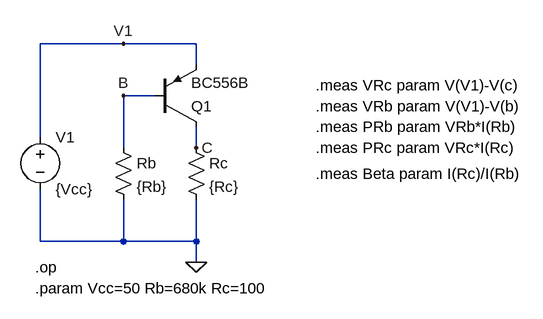
[diagram p0: schematic TBJ02.asc]
TBJ02.asc, the LTspice schematic file:
Version 4
SHEET 1 984 680
WIRE 256 -32 128 -32
WIRE 368 -32 256 -32
WIRE 368 0 368 -32
WIRE 304 48 256 48
WIRE 128 112 128 -32
WIRE 256 128 256 48
WIRE 368 128 368 96
WIRE 128 272 128 192
WIRE 256 272 256 208
WIRE 256 272 128 272
WIRE 368 272 368 208
WIRE 368 272 256 272
WIRE 368 304 368 272
FLAG 368 304 0
FLAG 256 -32 V1
FLAG 256 48 B
FLAG 368 128 C
SYMBOL voltage 128 96 R0
WINDOW 123 0 0 Left 0
WINDOW 39 0 0 Left 0
SYMATTR InstName V1
SYMATTR Value {Vcc}
SYMBOL res 240 112 R0
SYMATTR InstName Rb
SYMATTR Value {Rb}
SYMBOL res 352 112 R0
SYMATTR InstName Rc
SYMATTR Value {Rc}
SYMBOL pnp 304 96 M180
SYMATTR InstName Q1
SYMATTR Value BC556B
TEXT 120 312 Left 2 !.op
TEXT 120 344 Left 2 !.param Vcc=50 Rb=680k Rc=100
TEXT 552 32 Left 2 !.meas VRc param V(V1)-V(c)
TEXT 552 64 Left 2 !.meas VRb param V(V1)-V(b)
TEXT 552 96 Left 2 !.meas PRb param VRb*I(Rb)
TEXT 552 128 Left 2 !.meas PRc param VRc*I(Rc)
TEXT 552 168 Left 2 !.meas Beta param I(Rc)/I(Rb)

The netlist it stands for:
* TBJ02.asc
V1 V1 0 {Vcc}
Rb B 0 {Rb}
Rc C 0 {Rc}
Q1 C B V1 0 BC556B
.model NPN NPN
.model PNP PNP
.lib standard.bjt
.op
.param Vcc=50 Rb=680k Rc=100
.meas VRc param V(V1)-V(c)
.meas VRb param V(V1)-V(b)
.meas PRb param VRb*I(Rb)
.meas PRc param VRc*I(Rc)
.meas Beta param I(Rc)/I(Rb)
.backanno
.end